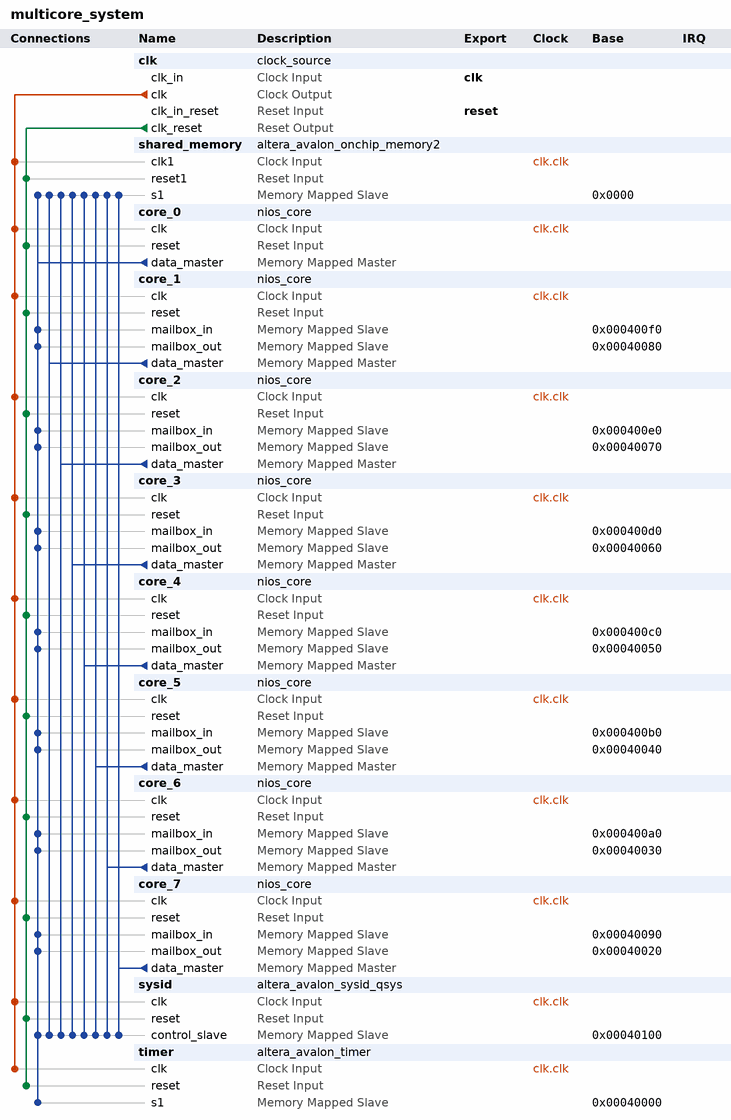
[diagram p0: system contents]
# Platform Designer (Qsys) system multicore_system, Cyclone V 5CSEMA5F31C6
# Parameters at their usual value, and those the tool derives, are not listed.
package require -exact qsys 18.1
create_system multicore_system
set_project_property DEVICE_FAMILY {Cyclone V}
set_project_property DEVICE 5CSEMA5F31C6

add_instance clk clock_source 18.1
set_instance_parameter_value clk clockFrequency 50000000

add_instance shared_memory altera_avalon_onchip_memory2 18.1
set_instance_parameter_value shared_memory dataWidth 32
set_instance_parameter_value shared_memory dualPort false
set_instance_parameter_value shared_memory initMemContent false
set_instance_parameter_value shared_memory initializationFileName onchip_mem.hex
set_instance_parameter_value shared_memory memorySize 135000

add_instance core_0 nios_core 1.0

add_instance core_1 nios_core 1.0

add_instance core_2 nios_core 1.0

add_instance core_3 nios_core 1.0

add_instance core_4 nios_core 1.0

add_instance core_5 nios_core 1.0

add_instance core_6 nios_core 1.0

add_instance core_7 nios_core 1.0

add_instance sysid altera_avalon_sysid_qsys 18.1
set_instance_parameter_value sysid id 0

add_instance timer altera_avalon_timer 18.1
set_instance_parameter_value timer period 1
set_instance_parameter_value timer periodUnits MSEC

# connections
add_connection clk.clk core_0.clk clock
add_connection clk.clk core_1.clk clock
add_connection clk.clk core_2.clk clock
add_connection clk.clk core_3.clk clock
add_connection clk.clk core_4.clk clock
add_connection clk.clk core_5.clk clock
add_connection clk.clk core_6.clk clock
add_connection clk.clk core_7.clk clock
add_connection clk.clk shared_memory.clk1 clock
add_connection clk.clk sysid.clk clock
add_connection clk.clk timer.clk clock
add_connection clk.clk_reset core_0.reset reset
add_connection clk.clk_reset core_1.reset reset
add_connection clk.clk_reset core_2.reset reset
add_connection clk.clk_reset core_3.reset reset
add_connection clk.clk_reset core_4.reset reset
add_connection clk.clk_reset core_5.reset reset
add_connection clk.clk_reset core_6.reset reset
add_connection clk.clk_reset core_7.reset reset
add_connection clk.clk_reset shared_memory.reset1 reset
add_connection clk.clk_reset sysid.reset reset
add_connection clk.clk_reset timer.reset reset
add_connection core_0.data_master core_1.mailbox_in avalon
set_connection_parameter_value core_0.data_master/core_1.mailbox_in baseAddress 0x000400f0
add_connection core_0.data_master core_1.mailbox_out avalon
set_connection_parameter_value core_0.data_master/core_1.mailbox_out baseAddress 0x00040080
add_connection core_0.data_master core_2.mailbox_in avalon
set_connection_parameter_value core_0.data_master/core_2.mailbox_in baseAddress 0x000400e0
add_connection core_0.data_master core_2.mailbox_out avalon
set_connection_parameter_value core_0.data_master/core_2.mailbox_out baseAddress 0x00040070
add_connection core_0.data_master core_3.mailbox_in avalon
set_connection_parameter_value core_0.data_master/core_3.mailbox_in baseAddress 0x000400d0
add_connection core_0.data_master core_3.mailbox_out avalon
set_connection_parameter_value core_0.data_master/core_3.mailbox_out baseAddress 0x00040060
add_connection core_0.data_master core_4.mailbox_in avalon
set_connection_parameter_value core_0.data_master/core_4.mailbox_in baseAddress 0x000400c0
add_connection core_0.data_master core_4.mailbox_out avalon
set_connection_parameter_value core_0.data_master/core_4.mailbox_out baseAddress 0x00040050
add_connection core_0.data_master core_5.mailbox_in avalon
set_connection_parameter_value core_0.data_master/core_5.mailbox_in baseAddress 0x000400b0
add_connection core_0.data_master core_5.mailbox_out avalon
set_connection_parameter_value core_0.data_master/core_5.mailbox_out baseAddress 0x00040040
add_connection core_0.data_master core_6.mailbox_in avalon
set_connection_parameter_value core_0.data_master/core_6.mailbox_in baseAddress 0x000400a0
add_connection core_0.data_master core_6.mailbox_out avalon
set_connection_parameter_value core_0.data_master/core_6.mailbox_out baseAddress 0x00040030
add_connection core_0.data_master core_7.mailbox_in avalon
set_connection_parameter_value core_0.data_master/core_7.mailbox_in baseAddress 0x00040090
add_connection core_0.data_master core_7.mailbox_out avalon
set_connection_parameter_value core_0.data_master/core_7.mailbox_out baseAddress 0x00040020
add_connection core_0.data_master shared_memory.s1 avalon
set_connection_parameter_value core_0.data_master/shared_memory.s1 baseAddress 0x0000
add_connection core_0.data_master sysid.control_slave avalon
set_connection_parameter_value core_0.data_master/sysid.control_slave baseAddress 0x00040100
add_connection core_0.data_master timer.s1 avalon
set_connection_parameter_value core_0.data_master/timer.s1 baseAddress 0x00040000
add_connection core_1.data_master shared_memory.s1 avalon
set_connection_parameter_value core_1.data_master/shared_memory.s1 baseAddress 0x0000
add_connection core_1.data_master sysid.control_slave avalon
set_connection_parameter_value core_1.data_master/sysid.control_slave baseAddress 0x00040100
add_connection core_2.data_master shared_memory.s1 avalon
set_connection_parameter_value core_2.data_master/shared_memory.s1 baseAddress 0x0000
add_connection core_2.data_master sysid.control_slave avalon
set_connection_parameter_value core_2.data_master/sysid.control_slave baseAddress 0x00040100
add_connection core_3.data_master shared_memory.s1 avalon
set_connection_parameter_value core_3.data_master/shared_memory.s1 baseAddress 0x0000
add_connection core_3.data_master sysid.control_slave avalon
set_connection_parameter_value core_3.data_master/sysid.control_slave baseAddress 0x00040100
add_connection core_4.data_master shared_memory.s1 avalon
set_connection_parameter_value core_4.data_master/shared_memory.s1 baseAddress 0x0000
add_connection core_4.data_master sysid.control_slave avalon
set_connection_parameter_value core_4.data_master/sysid.control_slave baseAddress 0x00040100
add_connection core_5.data_master shared_memory.s1 avalon
set_connection_parameter_value core_5.data_master/shared_memory.s1 baseAddress 0x0000
add_connection core_5.data_master sysid.control_slave avalon
set_connection_parameter_value core_5.data_master/sysid.control_slave baseAddress 0x00040100
add_connection core_6.data_master shared_memory.s1 avalon
set_connection_parameter_value core_6.data_master/shared_memory.s1 baseAddress 0x0000
add_connection core_6.data_master sysid.control_slave avalon
set_connection_parameter_value core_6.data_master/sysid.control_slave baseAddress 0x00040100
add_connection core_7.data_master shared_memory.s1 avalon
set_connection_parameter_value core_7.data_master/shared_memory.s1 baseAddress 0x0000
add_connection core_7.data_master sysid.control_slave avalon
set_connection_parameter_value core_7.data_master/sysid.control_slave baseAddress 0x00040100

# exported interfaces
add_interface clk clock sink
set_interface_property clk EXPORT_OF clk.clk_in
add_interface reset reset sink
set_interface_property reset EXPORT_OF clk.clk_in_reset

set_interconnect_requirement {$system} qsys_mm.clockCrossingAdapter HANDSHAKE
set_interconnect_requirement {$system} qsys_mm.enableEccProtection FALSE
set_interconnect_requirement {$system} qsys_mm.insertDefaultSlave FALSE
set_interconnect_requirement {$system} qsys_mm.maxAdditionalLatency 1

save_system multicore_system.qsys
